# EAGLE design LS400 (EAGLE 8.6.3)
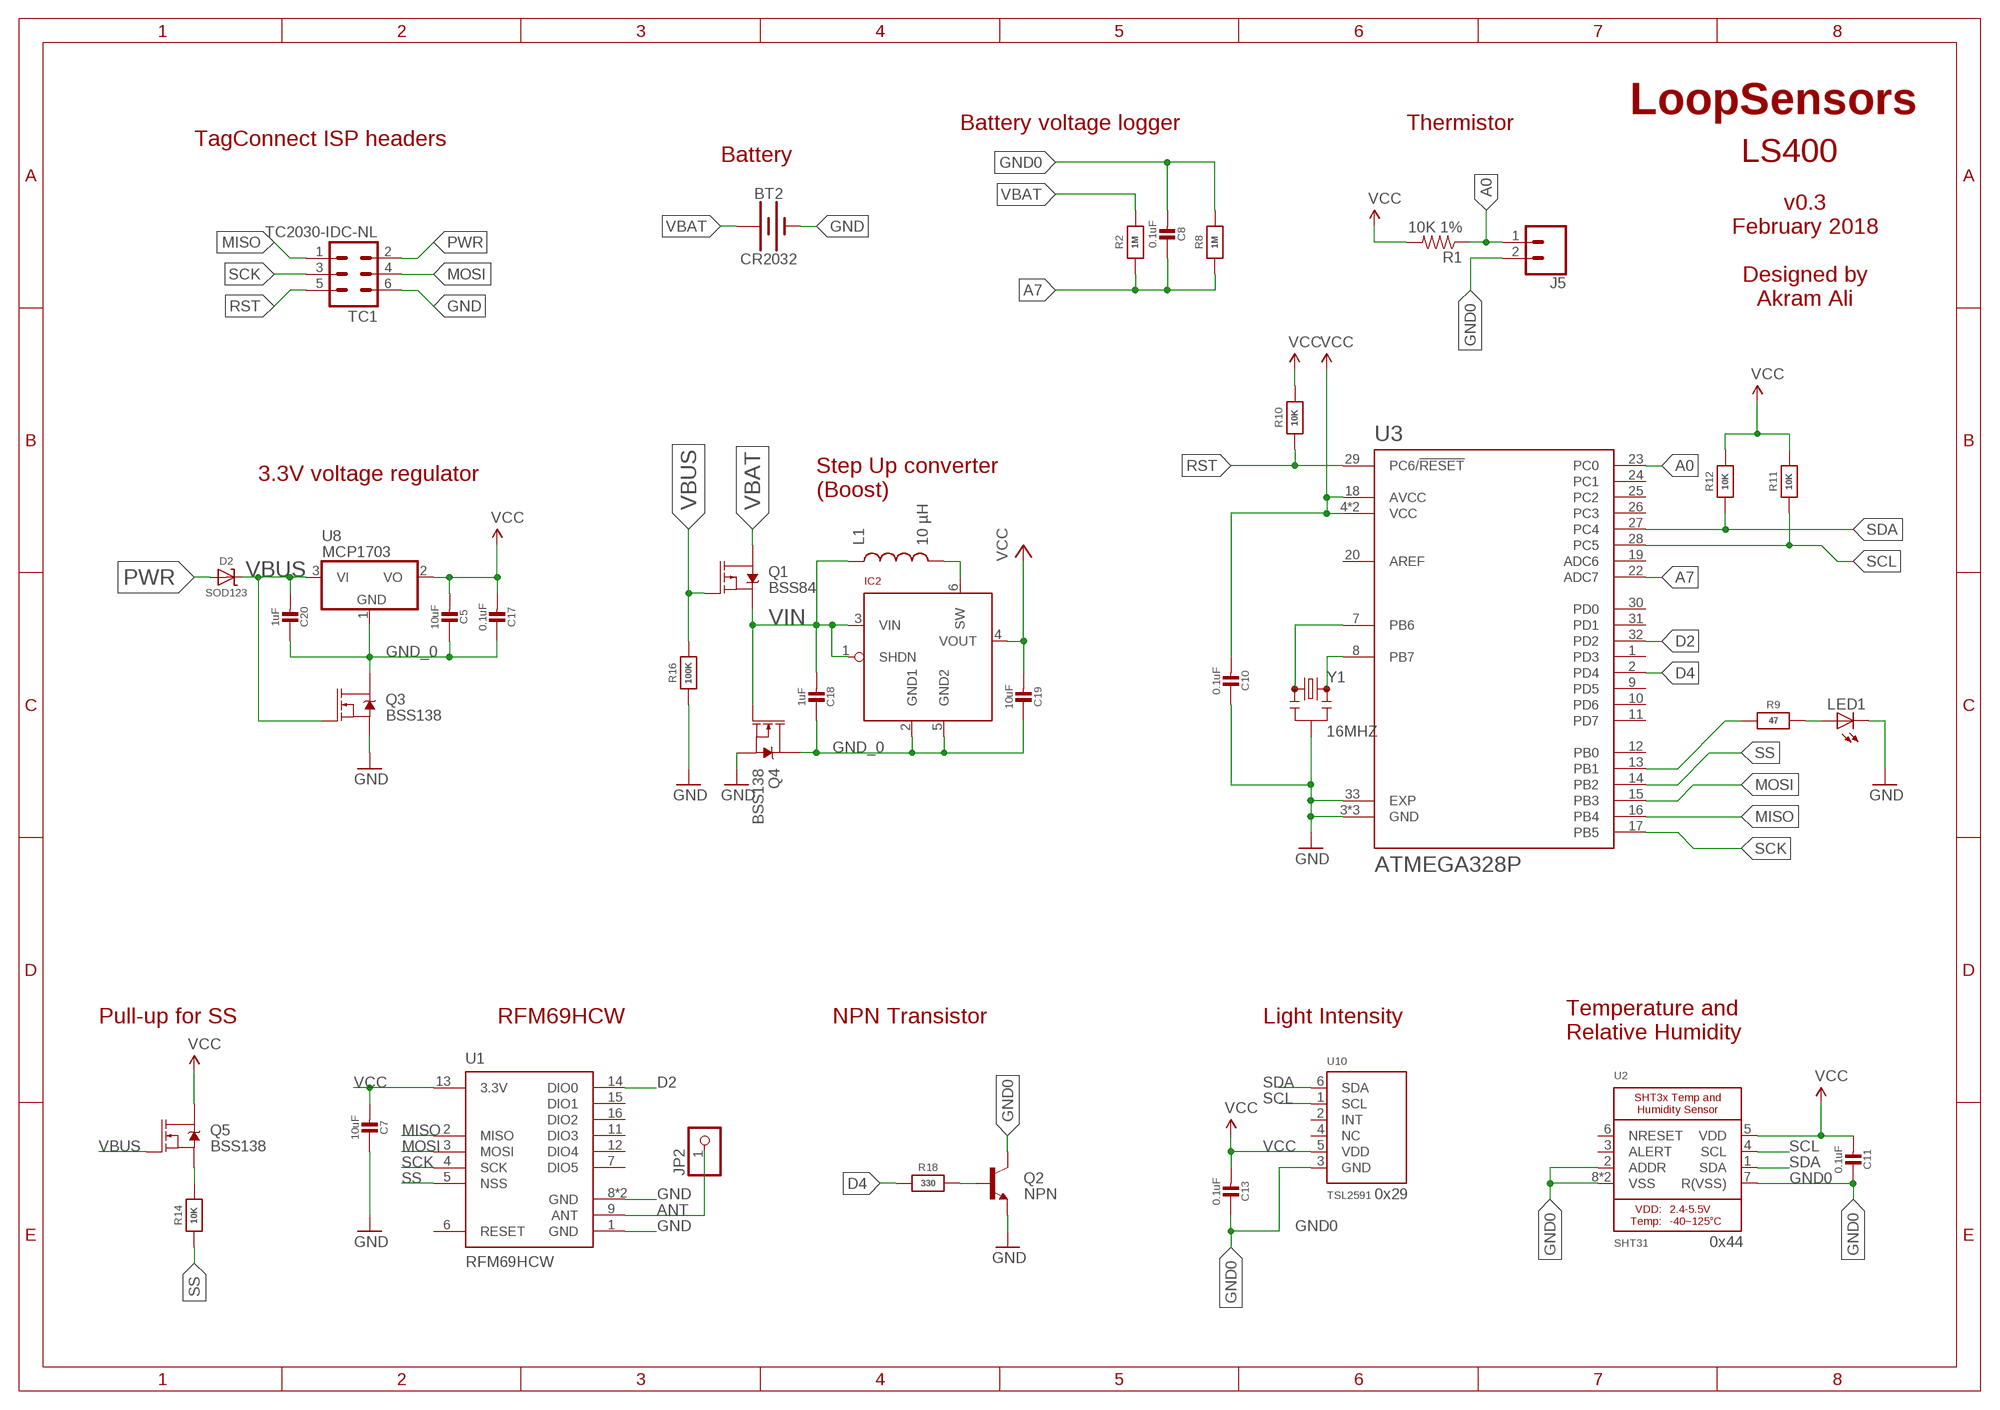
[diagram p0: schematic, sheet 1]

## Parts
BT2  CR2032  BATTERY-20MM_SMD_4LEGS  [BATTCON_20MM_4LEGS]
C5  10uF  MICROBUILDER_CAP_CERAMIC_0402MP  [MICROBUILDER__0402MP]
C7  10uF  MICROBUILDER_CAP_CERAMIC_0402MP  [MICROBUILDER__0402MP]
C8  0.1uF  MICROBUILDER_CAP_CERAMIC_0402MP  [MICROBUILDER__0402MP]
C10  0.1uF  MICROBUILDER_CAP_CERAMIC_0402MP  [MICROBUILDER__0402MP]
C11  0.1uF  MICROBUILDER_CAP_CERAMIC_0402MP  [MICROBUILDER__0402MP]
C13  0.1uF  MICROBUILDER_CAP_CERAMIC_0402MP  [MICROBUILDER__0402MP]
C17  0.1uF  MICROBUILDER_CAP_CERAMIC_0402MP  [MICROBUILDER__0402MP]
C18  1uF  MICROBUILDER_CAP_CERAMIC_0402MP  [MICROBUILDER__0402MP]
C19  10uF  MICROBUILDER_CAP_CERAMIC_0402MP  [MICROBUILDER__0402MP]
C20  1uF  MICROBUILDER_CAP_CERAMIC_0402MP  [MICROBUILDER__0402MP]
D2  SOD123  MICROBUILDER_DIODE-SCHOTTKYSOD-123  [MICROBUILDER_SOD-123]
IC2  LTC3525  [SC70]
J5  CONN_02  [1X02]
JP2  PINHD-1X1CB  [1X01-CLEANBIG]
L1  10 µH  INDUCTOR1210  [1210]
LED1  LEDCHIPLED_0603  [CHIPLED_0603]
Q1  BSS84  MOSFET_PCH-DMG2307L  [SOT23-3]
Q2  NPN  TRANSISTOR_NPNMMBT5088  [SOT23-3]
Q3  BSS138  MOSFET-NCH-BSS138  [SOT23-3]
Q4  BSS138  MOSFET-NCH-BSS138  [SOT23-3]
Q5  BSS138  MOSFET-NCH-BSS138  [SOT23-3]
R1  10K 1%  RESISTOR0805-RES  [0805]
R2  1M  MICROBUILDER_RESISTOR_0402MP  [MICROBUILDER__0402MP]
R8  1M  MICROBUILDER_RESISTOR_0402MP  [MICROBUILDER__0402MP]
R9  47  MICROBUILDER_RESISTOR_0402MP  [MICROBUILDER__0402MP]
R10  10K  MICROBUILDER_RESISTOR_0402MP  [MICROBUILDER__0402MP]
R11  10K  MICROBUILDER_RESISTOR_0402MP  [MICROBUILDER__0402MP]
R12  10K  MICROBUILDER_RESISTOR_0402MP  [MICROBUILDER__0402MP]
R14  10K  MICROBUILDER_RESISTOR_0402MP  [MICROBUILDER__0402MP]
R16  100K  MICROBUILDER_RESISTOR_0402MP  [MICROBUILDER__0402MP]
R18  330  MICROBUILDER_RESISTOR_0402MP  [MICROBUILDER__0402MP]
TC1  TC2030-IDC-NL  [TC2030-IDC-NL]
U1  RFM69HCW  [RFM69HCW-XXXS2]
U2  SHT31  SHT3X  [SHT3X]
U3  ATMEGA328P  ATMEGA328P-MU  [QFN50P500X500X100-33N]
U8  MCP1703  MCP1703CB  [SOT23]
U10  TSL2591  LIGHT_TSL2591  [DFN6_TAOS]
Y1  16MHZ  RESONATOR16MHZ  [RESONATOR-SMD]

## Nets
A0: J5.1 R1.1 U3.23(PC0)
A7: C8.1 R2.1 R8.1 U3.22(ADC7)
ANT: JP2.1 U1.9(ANT)
D2: U1.14(DIO0) U3.32(PD2)
D4: R18.1 U3.2(PD4)
GND: BT2.NEGATIVE(-) C7.1 C10.1 LED1.C Q2.2(E) Q3.2(S) Q4.2(S) R16.1 TC1.6 U1.1(GND) U1.8(GND) U1.10(GND) U3.3(GND) U3.5(GND) U3.21(GND) U3.33(EXP) Y1.2
GND0: C8.2 C11.1 C13.1 J5.2 Q2.3(C) R8.2 U2.2(ADDR) U2.7(R(VSS)) U2.8(VSS) U2.THERMAL(VSS) U10.3(GND)
GND_0: C5.1 C17.1 C18.1 C19.1 C20.1 IC2.2(GND1) IC2.5(GND2) Q3.3(D) Q4.3(D) U8.1(GND)
MISO: TC1.1 U1.2(MISO) U3.16(PB4)
MOSI: TC1.4 U1.3(MOSI) U3.15(PB3)
N$1: Q2.1(B) R18.2
N$2: R9.1 U3.13(PB1)
N$3: LED1.A R9.2
N$4: U3.8(PB7) Y1.3
N$5: U3.7(PB6) Y1.1
N$9: Q5.2(S) R14.2
N$13 [power]: IC2.6(SW) L1.2
PWR [power]: D2.A TC1.2
RST: R10.1 TC1.5 U3.29(PC6/!RESET)
SCK: TC1.3 U1.4(SCK) U3.17(PB5)
SCL: R11.1 U2.4(SCL) U3.28(PC5) U10.1(SCL)
SDA: R12.1 U2.1(SDA) U3.27(PC4) U10.6(SDA)
SS: R14.1 U1.5(NSS) U3.14(PB2)
VBAT: BT2.POSITIVE@1(+) BT2.POSITIVE@2(+) BT2.POSITIVE@3(+) BT2.POSITIVE@4(+) Q1.3(D) R2.2
VBUS [power]: C20.2 D2.C Q1.1(G) Q3.1(G) Q5.1(G) R16.2 U8.3(VI)
VCC: C5.2 C7.2 C10.2 C11.2 C13.2 C17.2 C19.2 IC2.4(VOUT) Q5.3(D) R1.2 R10.2 R11.2 R12.2 U1.13(3.3V) U2.5(VDD) U3.4(VCC) U3.6(VCC) U3.18(AVCC) U8.2(VO) U10.5(VDD)
VIN: C18.2 IC2.1(SHDN) IC2.3(VIN) L1.1 Q1.2(S) Q4.1(G)
Unconnected: U1.6(RESET) U1.7(DIO5) U1.11(DIO3) U1.12(DIO4) U1.15(DIO1) U1.16(DIO2) U2.3(ALERT) U2.6(NRESET) U3.1(PD3) U3.9(PD5) U3.10(PD6) U3.11(PD7) U3.12(PB0) U3.19(ADC6) U3.20(AREF) U3.24(PC1) U3.25(PC2) U3.26(PC3) U3.30(PD0) U3.31(PD1) U10.2(INT) U10.4(NC)

## Notes on the sheet
- LoopSensors
- Battery voltage logger | Thermistor
- TagConnect ISP headers
- Battery | LS400
- v0.3
  February 2018
  
  Designed by
  Akram Ali
- 3.3V voltage regulator
- Step Up converter
  (Boost)
- Pull-up for SS | RFM69HCW | NPN Transistor | Light Intensity
- Temperature and
  Relative Humidity
- 0x29
- 0x44

## Library data of the parts
BT2 = SparkFun-Batteries:BATTERY: Battery - Single Cell A variety of battery chemistries, sizes, and footprints. Device List: 20MM_PTH - Coin Cell Battery Holder - 20mm (PTH) <https://www.sparkfun.com/products/783> 6.8MM_PTH - Coin Cell Battery Holder - 6.8MM(SMD) <https://www.digikey.com/product-detail/en/seiko-instruments/MS621FE-FL11E/728-1057-ND/1889208?WT.srch=1&gclid=CNOQ5a6LzdQCFZS2wAodXCkE0g> 12MM_SMD - Coin Cell Battery Holder - 12mm (SMD) <https://www.sparkfun.com/products/10592> 12MM_PTH - Coin Cell Battery Holder - 12mm (PTH) <https://www.sparkfun.com/products/7948> 20MM_SMD - 20mm Coin Cell Battery Holder (SMD) (2 legs) Used on the Big Time Watch Kit <https://www.sparkfun.com/products/11734> 20MM_SMD_4LEGS - Coin Cell Battery Holder - 20mm (SMD) <https://www.sparkfun.com/products/11892> 20MM_SMD_4LEGS_OVERPASTE - Coin Cell Battery Holder - 20mm (SMD) <https://www.sparkfun.com/products/11892> (Over-paste on the legs) 24.5MM_PTH - Coin Cell Battery Holder - 24.5mm (PTH) <https://www.sparkfun.com/products/8863> 9V - 9V Battery Holder - PC Mount Used on the SparkFun SparkPunk Sound Kit <https://www.sparkfun.com/products/11177> and SparkFun SparkPunk Sequencer Kit <https://www.sparkfun.com/products/12707> 18650 - Battery Holder - 18650 (PTH) <https://www.sparkfun.com/products/13113> AA - Battery Holder - 1xAA (PTH) <https://www.sparkfun.com/products/7949> AAA - Battery Holder - 1xAAA (PTH) <https://www.sparkfun.com/products/12718> AA_KIT - Battery Holder - 1xAA (PTH) <https://www.sparkfun.com/products/7949> Special kit package - pads only have exposed copper on one side of the board. AAA_KIT - Battery Holder - 1xAAA (PTH) <https://www.sparkfun.com/products/12718> Special kit package - pads only have exposed copper on one side of the board.; PROD_ID: BATT-10373; SF_SKU: PRT-11892
C5 C7 C10 C11 C13 C17-C20 = Adafruit Feather 32u4 Bluefruit LE:MICROBUILDER_CAP_CERAMIC: Ceramic Capacitors For new designs, use the packages preceded by an '_' character since they are more reliable: The following footprints should be used on most boards: _0402 - Standard footprint for regular board layouts _0603 - Standard footprint for regular board layouts _0805 - Standard footprint for regular board layouts _1206 - Standard footprint for regular board layouts For extremely tight-pitch boards where space is at a premium, the following 'micro-pitch' footprints can be used (smaller pads, no silkscreen outline, etc.): _0402MP - Micro-pitch footprint for very dense/compact boards _0603MP - Micro-pitch footprint for very dense/compact boards _0805MP - Micro-pitch footprint for very dense/compact boards _1206MP - Micro-pitch footprint for very dense/compact boards; MPN: GRJ155R60J106ME11D
C8 = Adafruit Feather 32u4 Bluefruit LE:MICROBUILDER_CAP_CERAMIC: Ceramic Capacitors For new designs, use the packages preceded by an '_' character since they are more reliable: The following footprints should be used on most boards: _0402 - Standard footprint for regular board layouts _0603 - Standard footprint for regular board layouts _0805 - Standard footprint for regular board layouts _1206 - Standard footprint for regular board layouts For extremely tight-pitch boards where space is at a premium, the following 'micro-pitch' footprints can be used (smaller pads, no silkscreen outline, etc.): _0402MP - Micro-pitch footprint for very dense/compact boards _0603MP - Micro-pitch footprint for very dense/compact boards _0805MP - Micro-pitch footprint for very dense/compact boards _1206MP - Micro-pitch footprint for very dense/compact boards; MPN: GRM155R71C104KA88J
D2 = Adafruit Feather 32u4 Bluefruit LE:MICROBUILDER_DIODE-SCHOTTKY; MPN: SD103AW-13-F
IC2 = JeeLabs:LTC3525
J5 = SparkFun-Connectors:CONN_02: Multi connection point. Often used as Generic Header-pin footprint for 0.1 inch spaced/style header connections On any of the 0.1 inch spaced packages, you can populate with these: Break Away Headers - Straight <https://www.sparkfun.com/products/116> (PRT-00116) Break Away Male Headers - Right Angle <https://www.sparkfun.com/products/553> (PRT-00553) Female Headers <https://www.sparkfun.com/products/115> (PRT-00115) Break Away Headers - Machine Pin <https://www.sparkfun.com/products/117> (PRT-00117) Break Away Female Headers - Swiss Machine Pin <https://www.sparkfun.com/products/743> (PRT-00743) For SCREWTERMINALS and SPRING TERMINALS visit here: Screw Terimnals on SparkFun.com <https://www.sparkfun.com/search/results?term=Screw+Terminals> (5mm/3.5mm/2.54mm spacing) This device is also useful as a general connection point to wire up your design to another part of your project. Our various solder wires solder well into these plated through hole pads. Hook-Up Wire - Assortment (Stranded, 22 AWG) <https://www.sparkfun.com/products/11375> (PRT-11375) Hook-Up Wire - Assortment (Solid Core, 22 AWG) <https://www.sparkfun.com/products/11367> (PRT-11367) View the entire wire category on our website here <https://www.sparkfun.com/categories/141> Special notes: Molex polarized connector foot print use with: PRT-08233 with associated crimp pins and housings. 2.54_SCREWTERM for use with PRT-10571. 3.5mm Screw Terminal footprints for PRT-08084 5mm Screw Terminal footprints for use with PRT-08432
JP2 = adafruit:PINHD-1X1: Pin header 1x1 for 0.1" spacing With round pins
L1 = SparkFun:INDUCTOR: Inductors Basic Inductor/Choke - 0603 and 1206. Footprints are not proven and vary greatly between part numbers.
LED1 = adafruit:LED: LED OSRAM: - CHIPLED LG R971, LG N971, LY N971, LG Q971, LY Q971, LO R971, LY R971 LH N974, LH R974 LS Q976, LO Q976, LY Q976 LO Q996 - Hyper CHIPLED LW Q18S LB Q993, LB Q99A, LB R99A - SideLED LS A670, LO A670, LY A670, LG A670, LP A670 LB A673, LV A673, LT A673, LW A673 LH A674 LY A675 LS A676, LA A676, LO A676, LY A676, LW A676 LS A679, LY A679, LG A679 - Hyper Micro SIDELED® LS Y876, LA Y876, LO Y876, LY Y876 LT Y87S - SmartLED LW L88C, LW L88S LB L89C, LB L89S, LG L890 LS L89K, LO L89K, LY L89K LS L896, LA L896, LO L896, LY L896 - TOPLED LS T670, LO T670, LY T670, LG T670, LP T670 LSG T670, LSP T670, LSY T670, LOP T670, LYG T670 LG T671, LOG T671, LSG T671 LB T673, LV T673, LT T673, LW T673 LH T674 LS T676, LA T676, LO T676, LY T676, LB T676, LH T676, LSB T676, LW T676 LB T67C, LV T67C, LT T67C, LS T67K, LO T67K, LY T67K, LW E67C LS E67B, LA E67B, LO E67B, LY E67B, LB E67C, LV E67C, LT E67C LW T67C LS T679, LY T679, LG T679 LS T770, LO T770, LY T770, LG T770, LP T770 LB T773, LV T773, LT T773, LW T773 LH T774 LS E675, LA E675, LY E675, LS T675 LS T776, LA T776, LO T776, LY T776, LB T776 LHGB T686 LT T68C, LB T68C - Hyper Mini TOPLED® LB M676 - Mini TOPLED Santana® LG M470 LS M47K, LO M47K, LY M47K Source: http://www.osram.convergy.de/
Q1 = SparkFun-DiscreteSemi:MOSFET_PCH: P-channel MOSFETs Voltage controlled devices that allow control of high current outputs. SparkFun Products: SparkFun ESP32 Thing <https://www.sparkfun.com/products/13907> SparkFun ESP8266 Thing <https://www.sparkfun.com/products/13231>; PROD_ID: TRANS-11308; VALUE: 2.5A/30V/105mΩ
Q2 = SparkFun-DiscreteSemi:TRANSISTOR_NPN: Generic NPN BJT MMBT2222A - TRANS-08049 (SOT-23, 1A 40V) MPSA42 - TRANS-09116 (SOT-23, 500mA 300V) MMBT5088LT1G - TRANS-11160 (SOT-23, 50 mA 30V) BC547 - COM-08928 <http://www.sparkfun.com/products/8928> (TO-92 45V 100mA) (1.Collector 2.Base 3.Emitter) 2N3904 - COM-00521 <http://www.sparkfun.com/products/521> (TO-92 40V 200mA) (1.Emitter 2.Base 3.Collector) P2N2222A - COM-12852 <http://www.sparkfun.com/products/12852> (TO-92 40V 600mA) (1.Collector 2.Base 3.Emitter); PROD_ID: TRANS-11160; VALUE: MMBT5088
Q3-Q5 = SparkFun-DiscreteSemi:MOSFET-NCH: N-channel MOSFETs Voltage controlled devices that allow control of high current outputs. SparkFun Products: SparkFun OpenScale <https://www.sparkfun.com/products/13261> SparkFun Digital Sandbox <https://www.sparkfun.com/products/12651> SparkFun Monster Moto Shield <https://www.sparkfun.com/products/10182> SparkFun MOSFET Power Controller <https://www.sparkfun.com/products/11214>; PROD_ID: TRANS-00830; VALUE: 220mA/50V/3.5Ω
R1 = SparkFun-Passives:RESISTOR: Resistor Basic schematic elements and footprints for 0603, 1206, and PTH resistors.
R2 R8 = Adafruit Feather 32u4 Bluefruit LE:MICROBUILDER_RESISTOR: Resistors For new designs, use the packages preceded by an '_' character since they are more reliable: The following footprints should be used on most boards: _0402 - Standard footprint for regular board layouts _0603 - Standard footprint for regular board layouts _0805 - Standard footprint for regular board layouts _1206 - Standard footprint for regular board layouts For extremely tight-pitch boards where space is at a premium, the following 'micro-pitch' footprints can be used (smaller pads, no silkscreen outline, etc.): _0402MP - Micro-pitch footprint for very dense/compact boards _0603MP - Micro-pitch footprint for very dense/compact boards _0805MP - Micro-pitch footprint for very dense/compact boards _1206MP - Micro-pitch footprint for very dense/compact boards; MPN: RC0402JR-0710KL
R9-R12 R14 R16 R18 = Adafruit PowerBoost 1000C Rev B:MICROBUILDER_RESISTOR: Resistors For new designs, use the packages preceded by an '_' character since they are more reliable: The following footprints should be used on most boards: _0402 - Standard footprint for regular board layouts _0603 - Standard footprint for regular board layouts _0805 - Standard footprint for regular board layouts _1206 - Standard footprint for regular board layouts For extremely tight-pitch boards where space is at a premium, the following 'micro-pitch' footprints can be used (smaller pads, no silkscreen outline, etc.): _0402MP - Micro-pitch footprint for very dense/compact boards _0603MP - Micro-pitch footprint for very dense/compact boards _0805MP - Micro-pitch footprint for very dense/compact boards _1206MP - Micro-pitch footprint for very dense/compact boards; MPN: RC0402JR-071KL
TC1 = TagConnect:TC2030-IDC: Tag-Connect In Circuit Programming & Debug Cable 6 Pin http://www.tag-connect.com
U1 = SparkFun-RF:RFM69H; PROD_ID: IC-11997, IC-12053
U2 = Adafruit SHT31:SHT3X: SHT3x - Digital Temperature and Humidity Sensor Supply Voltage: 2.4-5.5V Humidity Accuracy: SHT30 = +/-3%RH, SHT31 = +/-2%RH Temperature Sensor: -40~125°C (+/-0.3°C from 10-55C); MPN: SHT35-DIS-B
U3 = ATMEGA328P-MU:ATMEGA328P-MU: ATmega Series 20 MHz 32 KB Flash 2 KB SRAM 8-Bit Microcontroller - QFN-32; AVAILABILITY: Good; DESCRIPTION: ATmega Series 20 MHz 32 KB Flash 2 KB SRAM 8-Bit Microcontroller - QFN-32; MF: Atmel; MP: ATMEGA328P-MU; PACKAGE: QFN-32 Atmel; PRICE: 2.55 USD
U8 = linear:MCP1703: 250 mA, 16V, Low Quiescent Current LDO Regulator Source: http://ww1.microchip.com/downloads/en/DeviceDoc/22049b.pdf; MPN: MCP1703T-2502E/CB; OC_NEWARK: 18T9177
U10 = TSL2591:LIGHT_TSL2591: TSL2591 Light-To-Digital Sensor; MPN: TSL25911FN
Y1 = SparkFun-FreqCtrl:RESONATOR: Resonator Small SMD resonator. Used, eg, on the Arduino Pro/ Pro Mini boards. 8MHz- XTAL-08895 16MHz- XTAL-08900; OC_NEWARK: unknown; PROD_ID: XTAL-08900

## Net classes
1 power: width 0.254 mm, clearance 0.203 mm

## Board
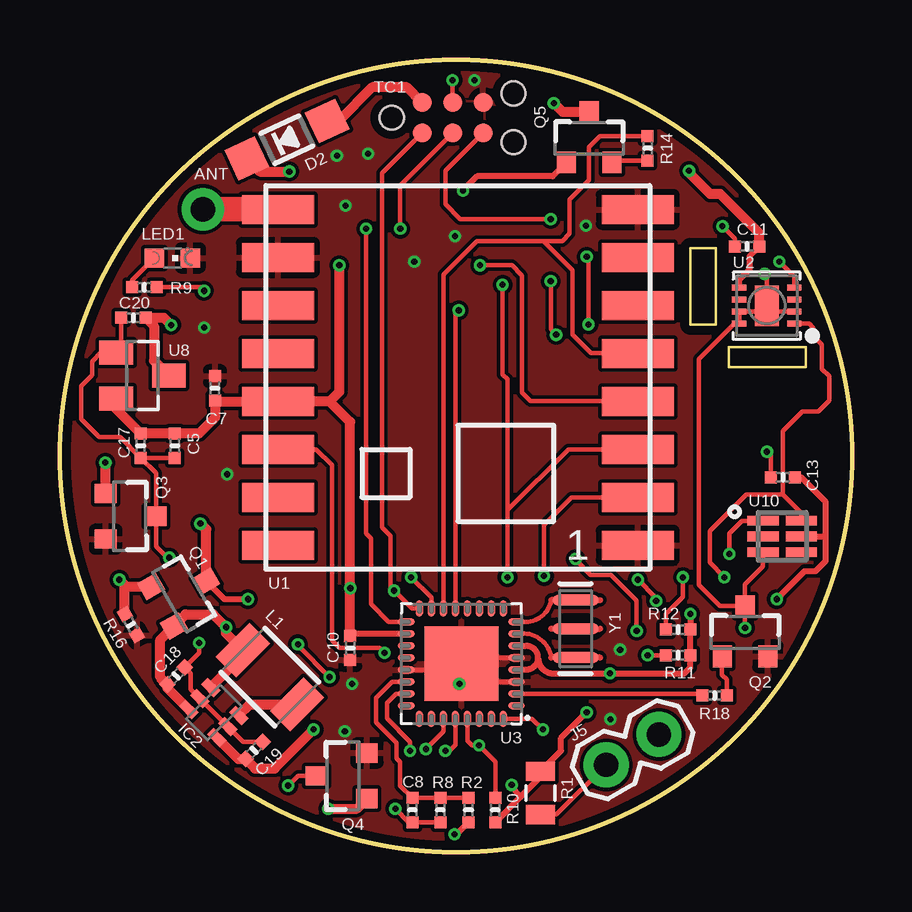
[diagram p1: board, top side]
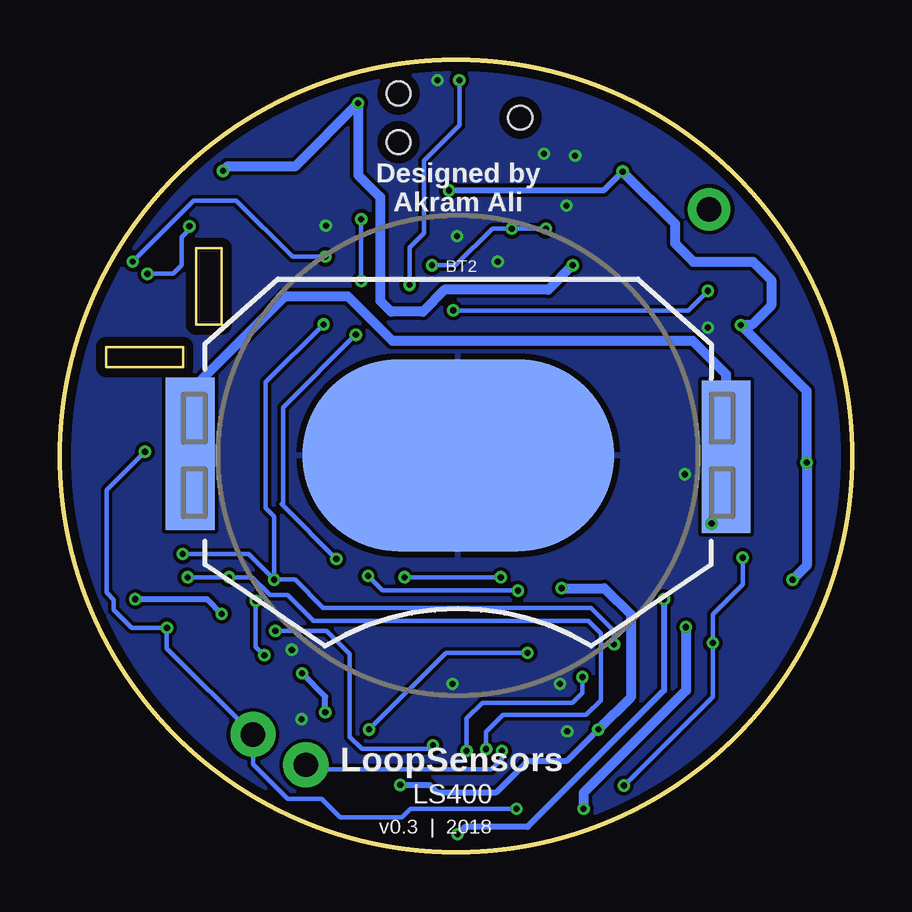
[diagram p2: board, bottom side, seen from below]

Size 33.02 x 33.02 mm. Coordinates in mm from the lower left corner, seen from the top.
Outline: 27.34,25.17 27.34,22 26.28,22 26.28,25.17 27.34,25.17
Outline: 27.88,21.06 31.1,21.06 31.1,20.22 27.88,20.22 27.88,21.06
Outline: circle at 16.51,16.51 radius 16.51
Copper layers (1*16): Top 0.035559375mm / dielectric 1.6mm / Bottom 0.035559375mm
Design rules "oshpark-2layer": minimum track width 6mil, minimum drill 10mil, track to track 6mil, track to pad 6mil, pad to pad 6mil, via to via 6mil, smd to smd 6mil, copper to edge 15mil, drill to drill 6mil, minimum pad ring 5mil, minimum via ring 5mil, stop-mask expansion 2.5mil, vias tented up to drill 0mil, thermal gap 10mil

### Footprints (pad centres in the part's own frame; a part is rotated, then mirrored left to right if it is on the bottom)
BATTCON_20MM_4LEGS = smd 13 x 8: NEGATIVE 0,0 | smd 2.032 x 3.175: POSITIVE@1 -11.176,1.651; POSITIVE@2 -11.176,-1.524; POSITIVE@3 11.176,1.524; POSITIVE@4 11.176,-1.651
MICROBUILDER__0402MP = smd 0.5 x 0.5: 1 -0.508,0; 2 0.508,0
MICROBUILDER_SOD-123 = smd 1.4 x 1.4: A 1.85,0; C -1.85,0
SC70 = smd 0.4 x 0.75: 1 -0.65,-0.825; 2 0,-0.825; 3 0.65,-0.825; 4 0.65,0.825; 5 0,0.825; 6 -0.65,0.825
1X02 = drill 1.016 pad 1.88: 1 0,0; 2 2.54,0
1X01-CLEANBIG = drill 1.016 pad 1.778: 1 0,0
1210 = smd 1.2 x 2: 1 -1.6,0; 2 1.6,0
CHIPLED_0603 = smd 0.8 x 0.8: A 0,-0.75; C 0,0.75
SOT23-3 = smd 0.8 x 0.9: 1 -0.95,-1; 2 0.95,-1; 3 0,1.1
0805 = smd 0.8 x 1.2: 1 -0.9,0; 2 0.9,0
TC2030-IDC-NL = smd 0.787 x 0.787: 1 -1.27,-0.635; 2 -1.27,0.635; 3 0,-0.635; 4 0,0.635; 5 1.27,-0.635; 6 1.27,0.635 | hole 0.991: -2.54,0; 2.54,1.016; 2.54,-1.016
RFM69HCW-XXXS2 = smd 3 x 1.2: 1 -7.5,7; 2 -7.5,5; 3 -7.5,3; 4 -7.5,1; 5 -7.5,-1; 6 -7.5,-3; 7 -7.5,-5; 8 -7.5,-7; 9 7.5,-7; 10 7.5,-5; 11 7.5,-3; 12 7.5,-1; 13 7.5,1; 14 7.5,3; 15 7.5,5; 16 7.5,7
SHT3X = smd 0.6 x 0.25: 1 -1.15,0.75; 2 -1.15,0.25; 3 -1.15,-0.25; 4 -1.15,-0.75; 5 1.15,-0.75; 6 1.15,-0.25; 7 1.15,0.25; 8 1.15,0.75 | smd 1 x 1.7: THERMAL 0,0
QFN50P500X500X100-33N = smd 0.7 x 0.3: 1 -2.3,1.75; 2 -2.3,1.25; 3 -2.3,0.75; 4 -2.3,0.25; 5 -2.3,-0.25; 6 -2.3,-0.75; 7 -2.3,-1.25; 8 -2.3,-1.75; 17 2.3,-1.75; 18 2.3,-1.25; 19 2.3,-0.75; 20 2.3,-0.25; 21 2.3,0.25; 22 2.3,0.75; 23 2.3,1.25; 24 2.3,1.75 | smd 0.3 x 0.7: 9 -1.75,-2.3; 10 -1.25,-2.3; 11 -0.75,-2.3; 12 -0.25,-2.3; 13 0.25,-2.3; 14 0.75,-2.3; 15 1.25,-2.3; 16 1.75,-2.3; 25 1.75,2.3; 26 1.25,2.3; 27 0.75,2.3; 28 0.25,2.3; 29 -0.25,2.3; 30 -0.75,2.3; 31 -1.25,2.3; 32 -1.75,2.3 | smd 3.1 x 3.1: 33 0,0
SOT23 = smd 1 x 1.4: 1 -0.95,-1.1; 2 0.95,-1.1; 3 0,1.1
DFN6_TAOS = smd 1.3 x 0.4: 1 -0.8,0.65; 2 -0.8,0; 3 -0.8,-0.65; 4 0.8,-0.65; 5 0.8,0; 6 0.8,0.65
RESONATOR-SMD = smd 0.45 x 1.905: 1 -1.2,0; 2 0,0; 3 1.2,0

### Placement (x,y rotation side)
BT2  16.42,16.54 0 bottom
C5  4.79,16.94 90 top
C7  6.46,19.33 270 top
C8  14.69,1.75 270 top
C10  12.1,8.51 90 top
C11  28.64,25.25 0 top
C13  30.14,15.62 0 top
C17  3.37,16.94 90 top
C18  4.84,7.34 225 top
C19  8.09,4.24 225 top
C20  3.06,22.28 0 top
D2  9.46,29.69 25 top
IC2  6.41,5.82 225 top
J5  22.77,3.63 30 top
JP2  5.96,26.8 0 top
L1  8.75,7.29 315 top
LED1  4.69,24.77 270 top
Q1  5.14,10.74 300 top
Q2  28.56,9.16 0 top
Q3  2.91,14 270 top
Q4  11.8,3.18 90 top
Q5  22.06,29.74 0 top
R1  20.03,2.46 90 top
R2  17.03,1.75 270 top
R8  15.86,1.75 270 top
R9  3.52,23.55 180 top
R10  18.15,1.75 270 top
R11  25.77,8.2 0 top
R12  25.77,9.27 0 top
R14  24.5,29.34 270 top
R16  2.96,9.47 120 top
R18  27.29,6.53 0 top
TC1  16.37,30.61 0 top
U1  16.59,19.79 180 top
U2  29.46,22.77 180 top
U3  16.74,7.85 180 top
U8  3.44,19.86 270 top
U10  30.11,13.16 0 top
Y1  21.5,9.31 90 top

### Tracks (layer width: path | path; a pad name or v marks a point on that pad's centre or on a via)
A0  (via drill 0.25)
  Top 0.178: U3.23 14,6.6 13.63,6.22 13.63,5.56 14.59,4.6 v14.59,4.22 | R1.1 20.7,1.56 J5.1
  Bottom 0.178: 22.52,3.38 J5.1 22.59,3.45 15.02,3.45 14.59,3.89 v14.59,4.22
A7
  Top 0.178: R2.1 R8.1 C8.1 14.19,2.77 14.19,3.76 14.03,3.91 14.03,4.55 13.17,5.41 13.17,6.43 13.84,7.1 U3.22
ANT
  Top 1.016: U1.9 9.08,26.8 JP2.1
D2  (via drill 0.25 pad 0.13)
  Top 0.178: U3.32 19.69,5.55 v20.13,5.11 | U1.14 arc90 U1.14 10.68,16.79 11.34,16.13 11.34,8.81 11.65,8.51 13.32,8.51 v13.53,8.31
  Bottom 0.178: v13.53,8.31 16.93,8.31 v20.13,5.11
D4
  Top 0.178: U3.2 26.71,6.6 R18.1
GND  (via drill 0.25 pad 0.13)
  Top 0.178: U3.21 16.49,7.6 arc90 U3.33 arc-90 16.99,8.1 17.23,8.1 | U3.3 18.23,7.1 arc-90 17.23,8.1 | U3.5 17.23,8.1
  other vias: 6.01,21.87 12.18,7.01 11.87,5.03 6.97,15.75 11.9,26.95 14.77,24.61 11.54,29.03 12.84,29.11 17.28,32.18 21.93,26.11 16.65,7.01 22.95,5.54 16.47,25.68 23.36,8.43
  pour Top: 16.37,34.82 arc90 -2.12,16.33 -2.12,16.28 arc90 16.57,-2.41 16.83,-2.41 arc90 35.12,15.88 35.12,16.94 arc90 17.18,34.87 16.37,34.87
  pour Bottom: 16.43,35.18 arc90 -2.43,16.32 -2.43,15.98 arc90 16.01,-2.46 16.55,-2.46 arc90 35.26,16.24 arc90 16.24,35.26 15.6,35.26
GND0  (via drill 0.25 pad 0.13)
  Top 0.178: U2.THERMAL arc-90 29.21,22.52 U2.7 U2.8 28.1,22.02 26.63,20.55 26.63,11.13 27.5,10.26 Q2.3 | U2.2 29.71,22.52 arc-90 U2.THERMAL | 29.48,22.78 arc-90 U2.THERMAL | U10.3 29.31,11.9 28.56,11.15 Q2.3 | R8.2 C8.2 14.54,1.24 v13.98,1.8 | Q2.3 v28.56,9.35 | U2.THERMAL 29.46,24.02 v29.38,24.1 | C11.1 28.13,25.58 v27.62,26.09 | C13.1 29.63,16.54 v29.48,16.69
  Bottom 0.178: v13.98,1.8 18.4,1.8 18.76,1.45 21.35,1.45 22.11,2.21 23.53,2.21 24.97,3.65 J5.2 28.56,8.49 v28.56,9.35 30.04,9.35 30.77,10.08 30.77,10.52 31.08,10.82 31.08,15.09 v29.48,16.69 | v29.38,24.1 28.31,24.1 27.95,24.46 27.95,25.63 27.62,25.96 v27.62,26.09
GND_0  (via drill 0.25, 0.25 pad 0.13)
  Top 0.178: C20.1 2.55,21.02 U8.1 1.7,20.81 1.33,20.45 1.33,19.89 0.88,19.43 0.88,18.06 1.64,17.3 2.5,17.3 C17.1 | C17.1 C5.1 | C17.1 4.01,15.79 Q3.3 4.01,12.74 4.48,12.27 v4.56,12.27 | v5.8,8.71 5.8,8.31 C18.1 5.45,7.45 5.45,6.78 IC2.2 IC2.5 7.63,4.6 C19.1 | Q4.3 9.92,3.18 v9.51,2.77
  Bottom 0.178: v9.51,2.77 5.8,6.48 v5.8,8.71 5.8,9.91 4.56,11.15 v4.56,12.27
MISO  (via drill 0.25 pad 0.13)
  Top 0.178: 24.06,14.81 arc-90 U1.2 21.33,14.79 20.18,13.64 v20.18,11.51 | TC1.1 13.42,28.3 13.42,13.54 13.78,13.18 13.78,11.05 v13.93,10.9 14.68,10.15 U3.16
  Bottom 0.178: v13.93,10.9 19.57,10.9 v20.18,11.51
MOSI  (via drill 0.25, 0.25 pad 0.13)
  Top 0.178: U1.3 arc-90 U1.3 21.19,16.79 18.66,14.25 | TC1.4 v16.37,32.18 | U3.15 15.49,10.61 v14.64,11.46 | v18.66,11.46 18.66,14.25 | v18.45,23.65 18.45,19.91 18.66,19.71 18.66,14.25
  Bottom 0.178: v16.37,32.18 16.37,30.3 17.84,28.83 17.84,25.81 18.45,25.2 v18.45,23.65 | v14.64,11.46 v18.66,11.46
N$1
  Top 0.178: R18.2 27.8,7.19 27.6,7.39 27.6,8.14 Q2.1
N$2  (via drill 0.25 pad 0.13)
  Top 0.178: R9.1 5.86,23.55 v6.01,23.39 | v16.62,22.58 16.49,22.44 U3.13
  Bottom 0.178: v16.62,22.58 6.82,22.58 v6.01,23.39
N$3
  Top 0.178: R9.2 3.01,23.84 LED1.A
N$4
  Top 0.178: U3.8 19.22,9.6 arc90 20.49,10.51
N$5
  Top 0.178: U3.7 19.14,9.1 arc-90 20.49,8.11
N$9
  Top 0.178: R14.2 23.1,28.83
  Top 0.254: 23.1,28.83 Q5.2
N$13
  Top 0.406: IC2.6 7.92,6.16 L1.2
PWR
  Top 0.406: D2.A 11.62,30.47 13.02,31.88 14.47,31.88 TC1.2
RST  (via drill 0.25, 0.25 pad 0.13)
  Top 0.178: TC1.5 16.07,28.4 16.07,27 16.68,26.39 v20.46,26.39 | U3.29 16.99,4.64 17.18,4.45 v17.46,4.45 18.15,3.76 R10.1 | v24.04,9.22 24.04,10.49 22.97,11.56 22.11,11.56 21.5,12.17 v21.5,12.22 | v20.69,21.56 20.46,21.79 v20.46,23.8
  Bottom 0.178: v21.5,12.22 23.72,14.44 | 23.72,14.44 23.79,14.5 | v24.04,9.22 21.91,9.22 20.94,8.26 20.94,4.8 20.43,4.29 17.62,4.29 v17.46,4.45 | 23.72,14.44 23.72,18.53 v20.69,21.56 | v20.46,23.8 v20.46,26.39
SCK  (via drill 0.25, 0.25 pad 0.13)
  Top 0.178: 24.07,18.77 arc90 U1.4 | 14.37,9.6 U3.17 13.71,9.6 12.97,10.34 12.97,13.08 12.76,13.28 v12.76,25.98 | TC1.3 14.19,27.79 v14.19,25.98 | U1.4 22.96,18.79 | v17.51,24.46 18.83,24.46 19.27,24.03 19.27,19.15 19.62,18.8 24.08,18.8 U1.4
  Bottom 0.178: v17.51,24.46 16.52,24.46 15,25.98 v14.19,25.98 v12.76,25.98
SCL  (via drill 0.25, 0.25 pad 0.13)
  Top 0.178: 29.03,13.81 U10.1 28.43,13.81 27.9,13.28 v27.9,12.42 | U2.4 30.61,23.98 v29.99,24.61 | U3.28 16.49,4.46 16.24,4.22 v16.07,4.22 | v9.92,8.66 9.92,8.61 v11.24,7.29 | R11.1 v24.5,8.2 | v24.09,11.35 24.85,10.59 v24.85,10.46 | v22.03,22 22.03,24.74 v21.96,24.82
  Bottom 0.178: v29.99,24.61 27.45,27.15 25.67,27.15 23.33,24.82 v21.96,24.82 | v16.07,4.22 16.07,5.56 15.41,6.22 11.65,6.22 11.24,6.63 v11.24,7.29 | v9.92,8.66 9.92,9.22 10.88,10.19 22.06,10.19 23.23,11.35 v24.09,11.35 | v24.85,10.46 24.85,8.56 v24.5,8.2 | v24.09,11.35 24.09,14 24.45,14.35 24.45,19.58 v22.03,22 | v27.9,12.42 25.16,12.42 v24.09,11.35
SDA  (via drill 0.25 pad 0.13)
  Top 0.178: 15.99,5.28 U3.27 | 30.14,14.91 28.61,14.91 27.09,13.39 27.09,12.07 v27.7,11.46 | U3.27 15.99,5.23 | U3.27 15.99,5.03 v15.25,4.29 | 30.14,14.91 30.14,17.55 30.95,18.36 31.61,18.36 32.07,18.82 32.07,19.84 31.76,20.14 31.76,21.16 31.41,21.51 31.41,21.84 31.23,22.02 U2.1 30.9,22.02 | U10.6 30.91,14.14 30.14,14.91 | R12.1 25.26,9.93 25.97,10.64 v25.97,11.46
  Bottom 0.178: v27.7,11.46 v25.97,11.46 25.01,11.46 24.27,10.72 23.53,10.72 22.44,9.63 10.99,9.63 10.48,9.12 10.48,6.32 11.09,5.72 14.54,5.72 15.25,5 v15.25,4.29
SS
  Top 0.178: R14.1 22.52,29.85 22.06,29.39 22.06,28.02 21.25,27.2 21.25,25.78 20.94,25.48 20.16,25.48 | U1.5 24.07,20.8 22.14,20.8 21.37,21.56 21.37,24.26 20.16,25.48 | U3.14 15.99,24.08 17.39,25.48 20.16,25.48
VBAT  (via drill 0.25)
  Top 0.254: Q1.3 6.85,10.54 v7.84,10.54 | v16.45,0.74 16.52,0.74 R2.2
  Top 0.406: Q1.3 6.1,13.45 v5.86,13.69
  Bottom 0.178: BT2.POSITIVE@4 5.25,14.3 | BT2.POSITIVE@1 BT2.POSITIVE@2
  Bottom 0.254: v7.84,10.54 7.84,6.73 13.53,1.04 16.14,1.04 v16.45,0.74
  Bottom 0.406: BT2.POSITIVE@4 BT2.POSITIVE@3 5.25,19.91 6.64,21.31 19.16,21.31 21.02,23.16 23.66,23.16 27.6,19.23 BT2.POSITIVE@1 | 5.25,14.3 v5.86,13.69
VBUS  (via drill 0.25)
  Top 0.254: 1.91,16.21 v1.89,16.23 | Q5.1 20.54,28.17 17.39,28.17 v16.8,27.58
  Top 0.406: D2.C 8.32,28.37 v9.56,28.37 | v4.64,21.97 4.33,22.28 C20.2 3.92,21.92 3.92,20.48 U8.3 | Q3.1 1.91,16.21 | Q1.1 2.76,11.07 v2.48,11.35 2.71,11.13 R16.2
  Bottom 0.254: 1.99,16.23 v1.89,16.23 | v16.8,27.58 10.35,27.58 v9.56,28.37
  Bottom 0.406: v9.56,28.37 7.38,26.19 7.38,25.37 6.62,24.61 4.13,24.61 3.37,23.85 3.37,22.78 4.18,21.97 v4.64,21.97 1.89,19.23 v1.89,16.23 1.89,11.94 v2.48,11.35
VCC  (via drill 0.25 pad 0.13)
  Top 0.178: 20.03,3.12 R1.2
  Top 0.254: U1.13 arc90 U1.13 | U3.6 19.43,8.6 arc-90 19.93,8.1 | 19.93,8.1 arc-90 19.42,7.6 U3.4 | 19.93,8.1 arc90 20.59,7.44 v22.92,7.44 26.02,7.44 26.28,7.7 R11.2 R12.2 v26.28,9.93 | 31.92,13.16 31.92,12.12 31.51,11.71 31.05,11.71 v29.88,10.54 | 31.92,13.16 31.92,14.61 30.9,15.62 C13.2 | U10.5 31.92,13.16 | C10.2 12.19,9.1 U3.18 | C7.2 6.5,18.79 | U8.2 2.34,18.47 | R10.2 19.2,2.3 | 19.2,2.3 20.03,3.12 | R1.2 20.89,4.23 20.89,4.75 v21.96,5.82 | U2.5 28.31,23.86 28.74,24.28 28.74,24.84 C11.2 | 19.2,2.3 18.83,2.67 v18.83,2.79
  Top 0.406: 11.24,18.79 U1.13 6.5,18.79 | C10.2 v12.1,11 12.1,17.93 11.24,18.79 | C7.2 6.46,18.11 5.8,17.45 C5.2 C17.2 2.34,18.47 | IC2.4 7.43,3.88 C19.2 8.13,3.48 8.95,3.48 v10.58,5.11 | Q5.3 20.96,30.84 v20.59,31.22 | 11.24,18.79 11.65,19.19 v11.65,24.46 | C11.2 29.15,25.81 27.52,27.43 27.11,27.43 26.23,28.32 v26.23,28.4
  Bottom 0.254: v21.96,5.82 21.96,6.48 v22.92,7.44 | v26.28,9.93 26.89,10.54 v29.88,10.54 | v18.83,2.79 17.62,2.79 17.31,2.49 14.82,2.49 13.5,3.81 11.87,3.81 v10.58,5.11
  Bottom 0.406: v10.58,5.11 9.21,6.48 9.21,9.88 10.33,11 v12.1,11 | v11.65,24.46 12.66,23.44 16.98,23.44 17.89,22.53 19.22,22.53 19.67,22.99 19.67,27.31 20.59,28.22 v20.59,31.22 23.23,28.58 26.05,28.58 v26.23,28.4
VIN  (via drill 0.25)
  Top 0.406: IC2.1 7.62,8.19 L1.1 6.92,9.12 v6.92,9.37 6.39,9.91 5.24,9.91 Q1.2 4.18,8.85 4.18,7.28 C18.2 4.48,6.83 IC2.3 | v11.19,1.8 12.38,1.8 Q4.1
  Bottom 0.406: v11.19,1.8 11.19,2.46 6.92,6.73 v6.92,9.37

### Text on the board
_tsilk: ANT
_bsilk: Designed by / Akram Ali | LoopSensors | LS400 | v0.3 | 2018